# EAGLE design shiftregboard (EAGLE 7.5.0)
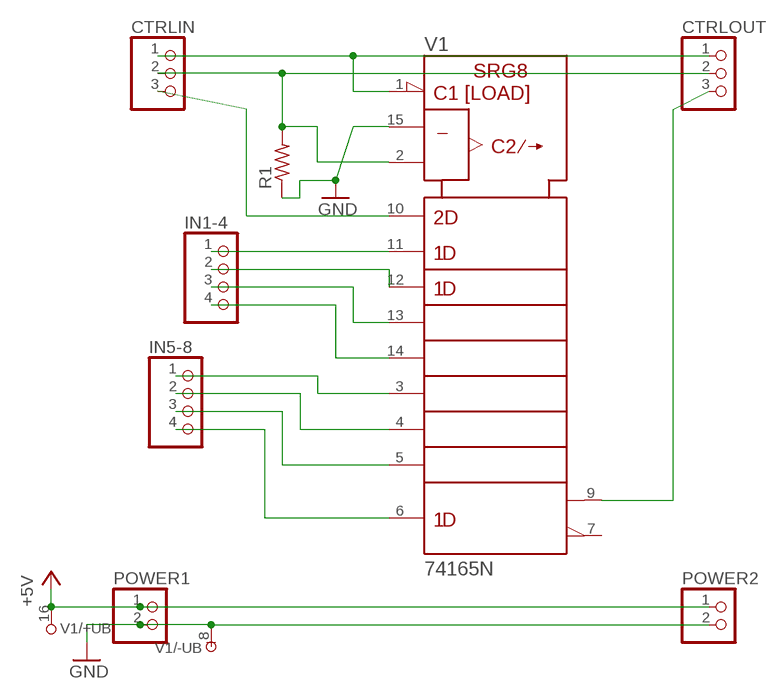
[diagram p0: schematic, sheet 1]

## Parts
CTRLIN  PINHD-1X3  [1X03]
CTRLOUT  PINHD-1X3  [1X03]
IN1-4  PINHD-1X4  [1X04]
IN5-8  PINHD-1X4  [1X04]
POWER1  PINHD-1X2  [1X02]
POWER2  PINHD-1X2  [1X02]
R1  R-US_0207/15  [0207/15]
V1  74165N  [DIL16]

## Nets
+5V: POWER1.1 POWER2.1 V1.16(+UB)
GND: POWER1.2 POWER2.2 R1.1 V1.8(-UB) V1.15(CLK_INH)
N$2: CTRLIN.2 CTRLOUT.2 R1.2 V1.2(CLK)
N$3: IN1-4.1 V1.11(A)
N$4: IN1-4.2 V1.12(B)
N$5: IN1-4.3 V1.13(C)
N$6: IN1-4.4 V1.14(D)
N$7: IN5-8.1 V1.3(E)
N$8: IN5-8.2 V1.4(F)
N$9: IN5-8.3 V1.5(G)
N$10: IN5-8.4 V1.6(H)
N$11: CTRLIN.3 V1.10(SER)
N$12: CTRLOUT.3 V1.9(QH)
N$13: CTRLIN.1 CTRLOUT.1 V1.1(SH/!LD)
Unconnected: V1.7(!QH)

## Library data of the parts
CTRLIN CTRLOUT = pinhead:PINHD-1X3: PIN HEADER
IN1-4 IN5-8 = pinhead:PINHD-1X4: PIN HEADER
POWER1 POWER2 = pinhead:PINHD-1X2: PIN HEADER
R1 = resistor:R-US_: RESISTOR, American symbol
V1 = 74ttl-din:74*165: 8-bit parallel load SHIFT REGISTER

## Board
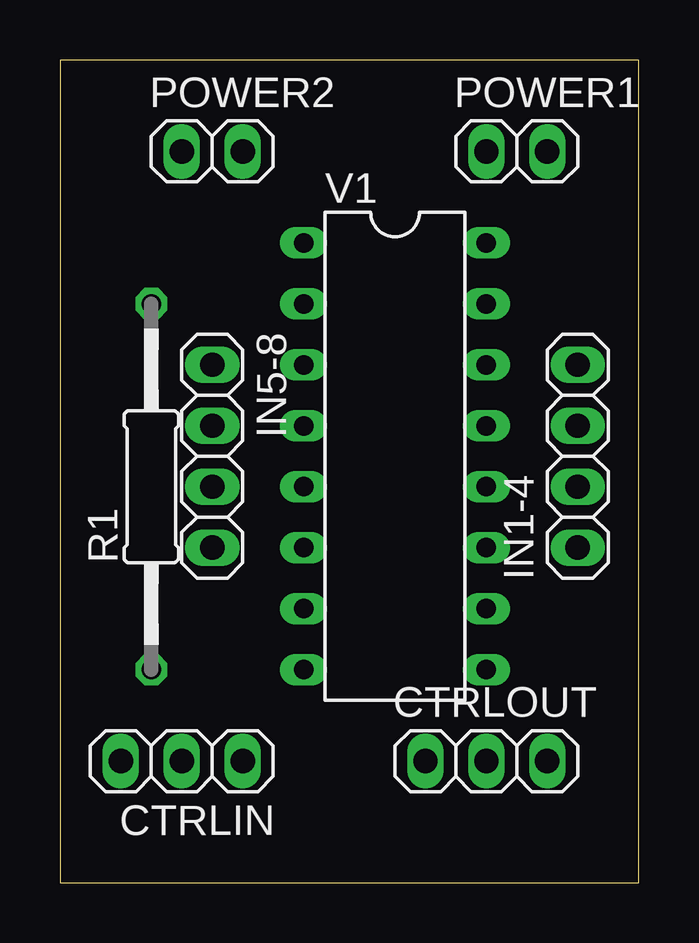
[diagram p1: board, top side]
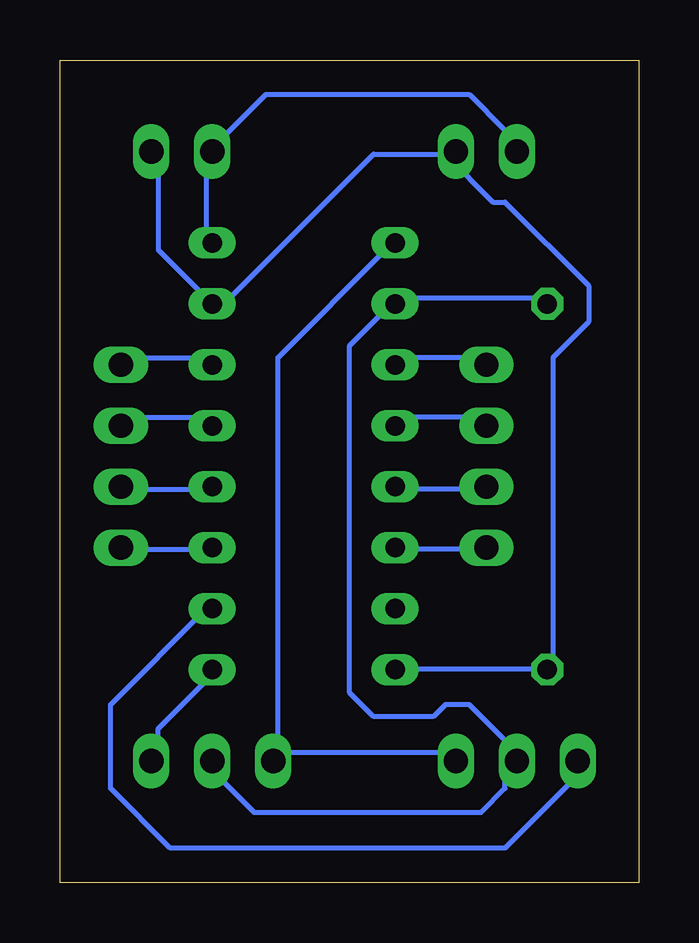
[diagram p2: board, bottom side, seen from below]

Size 24.13 x 34.29 mm. Coordinates in mm from the lower left corner, seen from the top.
Copper layers (1*16): Top 0.035mm / dielectric 1.5mm / Bottom 0.035mm
Design rules "Othermill-DRC-1-32": minimum track width 8mil, minimum drill 0.8mm, track to track 0.794003125mm, track to pad 0.794003125mm, pad to pad 0.794003125mm, via to via 0.794003125mm, smd to smd 0mil, copper to edge 0mil, drill to drill 1mil, minimum pad ring 10mil, minimum via ring 10mil, stop-mask expansion 1mil, vias tented up to drill 30mil, thermal gap 10mil

### Footprints (pad centres in the part's own frame; a part is rotated, then mirrored left to right if it is on the bottom)
1X03 = drill 1.016 long: 1 -2.54,0; 2 0,0; 3 2.54,0
1X04 = drill 1.016 long: 1 -3.81,0; 2 -1.27,0; 3 1.27,0; 4 3.81,0
1X02 = drill 1.016 long: 1 -1.27,0; 2 1.27,0
0207/15 = drill 0.813 octagon: 1 -7.62,0; 2 7.62,0
DIL16 = drill 0.813 long: 1 -8.89,-3.81; 2 -6.35,-3.81; 3 -3.81,-3.81; 4 -1.27,-3.81; 5 1.27,-3.81; 6 3.81,-3.81; 7 6.35,-3.81; 8 8.89,-3.81; 9 8.89,3.81; 10 6.35,3.81; 11 3.81,3.81; 12 1.27,3.81; 13 -1.27,3.81; 14 -3.81,3.81; 15 -6.35,3.81; 16 -8.89,3.81

### Placement (x,y rotation side)
CTRLIN  5.08,5.08 180 top
CTRLOUT  17.78,5.08 0 top
IN1-4  21.59,17.78 90 top
IN5-8  6.35,17.78 270 top
POWER1  19.05,30.48 0 top
POWER2  6.35,30.48 0 top
R1  3.81,16.51 90 top
V1  13.97,17.78 270 top

### Tracks (layer width: path | path; a pad name or v marks a point on that pad's centre or on a via)
+5V
  Bottom 0.203: V1.16 18.03,26.88 18.03,30.37 POWER1.1 17.54,30.87 15.54,32.86 7.06,32.86 5.57,31.37 5.57,30.87 POWER2.1
GND
  Bottom 0.203: V1.8 10.06,8.93 4.07,8.93 R1.1 3.57,8.93 3.57,21.89 2.08,23.39 2.08,24.88 5.57,28.37 6.07,28.37 8.06,30.37 | POWER1.2 20.03,30.37 20.03,26.38 V1.15 17.54,23.89 11.05,30.37 8.06,30.37 | 8.06,30.37 POWER2.2
N$2
  Bottom 0.203: R1.2 4.07,24.38 10.06,24.38 V1.2 10.55,23.89 12.05,22.39 12.05,7.93 11.05,6.93 8.56,6.93 8.06,7.43 7.06,7.43 5.07,5.44 CTRLIN.2 5.57,4.94 5.57,3.94 6.57,2.95 16.04,2.95 18.03,4.94 CTRLOUT.2
N$3
  Bottom 0.203: V1.11 18.03,13.91 21.52,13.91 IN1-4.1
N$4
  Bottom 0.203: V1.12 18.03,16.41 21.52,16.41 IN1-4.2
N$5
  Bottom 0.203: V1.13 18.03,19.4 21.52,19.4 IN1-4.3
N$6
  Bottom 0.203: V1.14 18.03,21.89 21.52,21.89 IN1-4.4
N$7
  Bottom 0.203: V1.3 10.06,21.89 6.57,21.89 IN5-8.1
N$8
  Bottom 0.203: V1.4 10.06,19.4 6.57,19.4 IN5-8.2
N$9
  Bottom 0.203: V1.5 10.06,16.41 6.57,16.41 IN5-8.3
N$10
  Bottom 0.203: V1.6 10.06,13.91 6.57,13.91 IN5-8.4
N$11
  Bottom 0.203: V1.10 18.03,11.42 22.02,7.43 22.02,3.94 19.53,1.45 5.57,1.45 2.08,4.94 CTRLIN.3
N$12
  Bottom 0.203: V1.9 18.03,8.43 20.03,6.44 20.03,5.44 CTRLOUT.3
N$13
  Bottom 0.203: 15.04,5.44 15.04,21.89 10.55,26.38 V1.1 | 15.04,5.44 8.06,5.44 CTRLIN.1 | 15.04,5.44 CTRLOUT.1